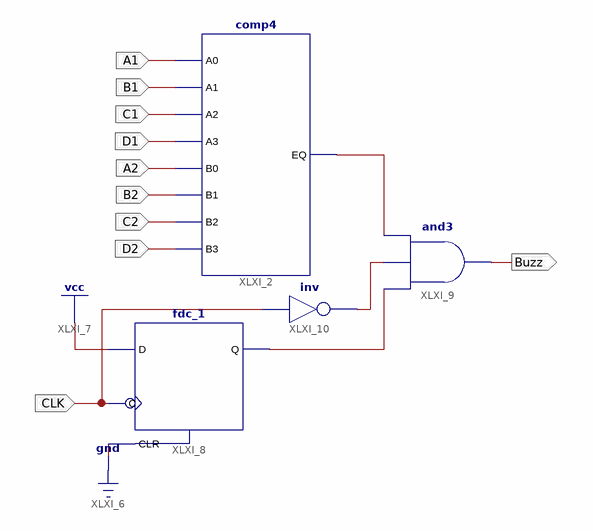
[diagram p0: schematic sheet 1]
// Xilinx ISE schematic Comparator.sch (spartan6) as structural Verilog: 4 symbols, 10 ports
module Comparator (
  input  A1,
  input  B1,
  input  C1,
  input  D1,
  input  A2,
  input  B2,
  input  C2,
  input  D2,
  input  CLK,
  output Buzz
);

  wire XLXN_9, XLXN_16, XLXN_18;

  comp4 XLXI_2 (.A0(A1), .A1(B1), .A2(C1), .A3(D1), .B0(A2), .B1(B2), .B2(C2), .B3(D2), .EQ(XLXN_9));
  fdc_1 XLXI_8 (.C(CLK), .CLR(1'b0), .D(1'b1), .Q(XLXN_16));
  and XLXI_9 (Buzz, XLXN_16, XLXN_18, XLXN_9);
  not XLXI_10 (XLXN_18, CLK);
endmodule
